# Altium schematic sheet 05_HDMI_to_DP.SchDoc: HDMI to DisplayPort
size A2; Organization: Greenfield Tech Solutions; Address1: Molendreef 33; Address2: Ossendrecht; Address3: 4641CS; Address4: The Netherlands; SheetNumber: 5; SheetTotal: 11
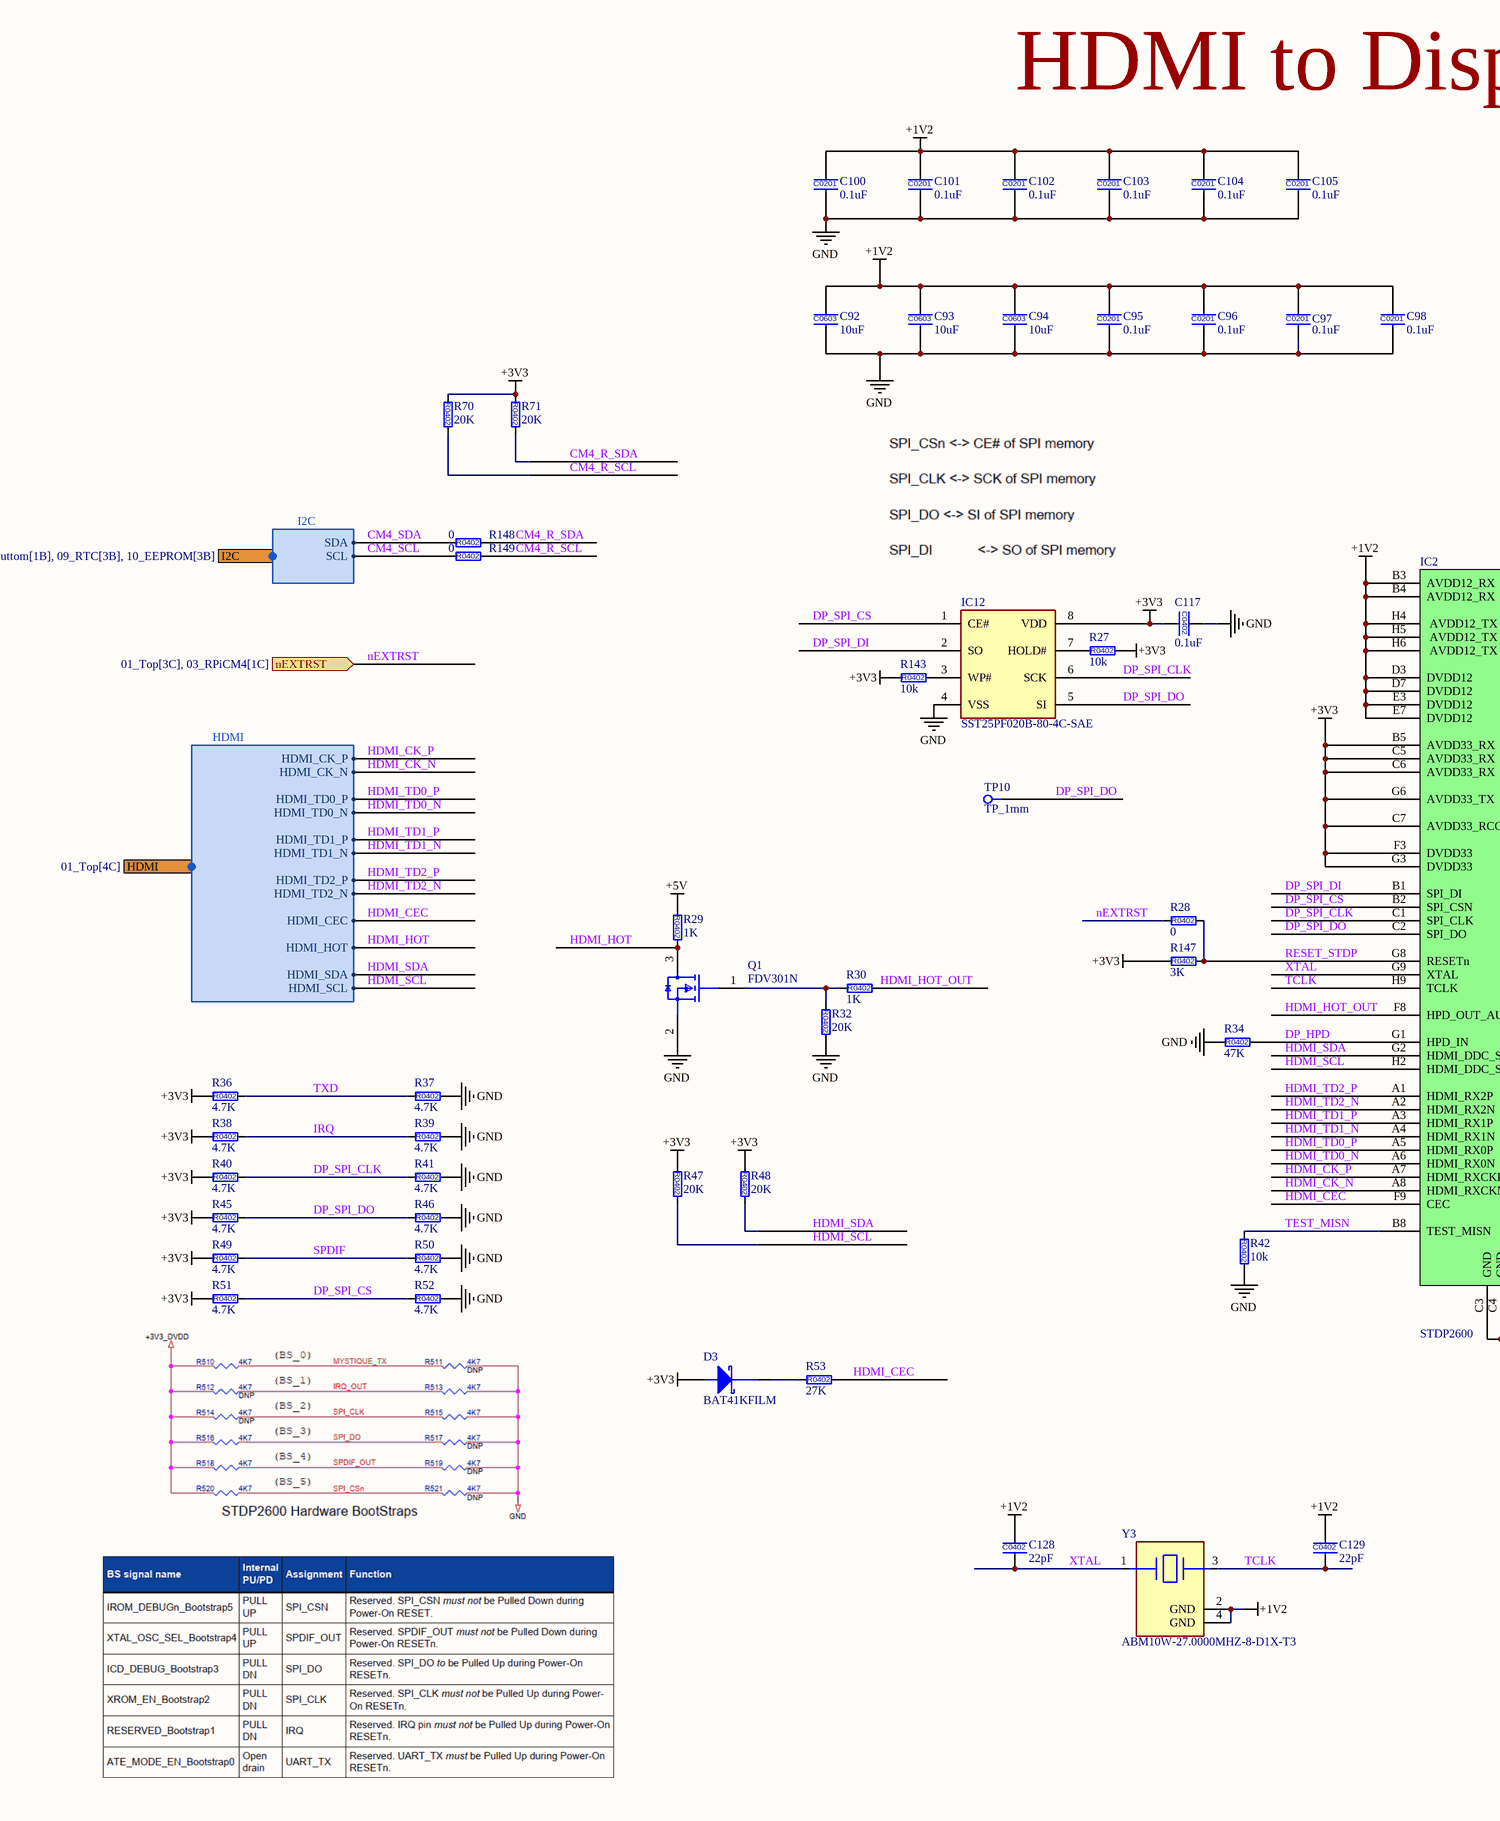
[diagram p0: 05_HDMI_to_DP.SchDoc, left]
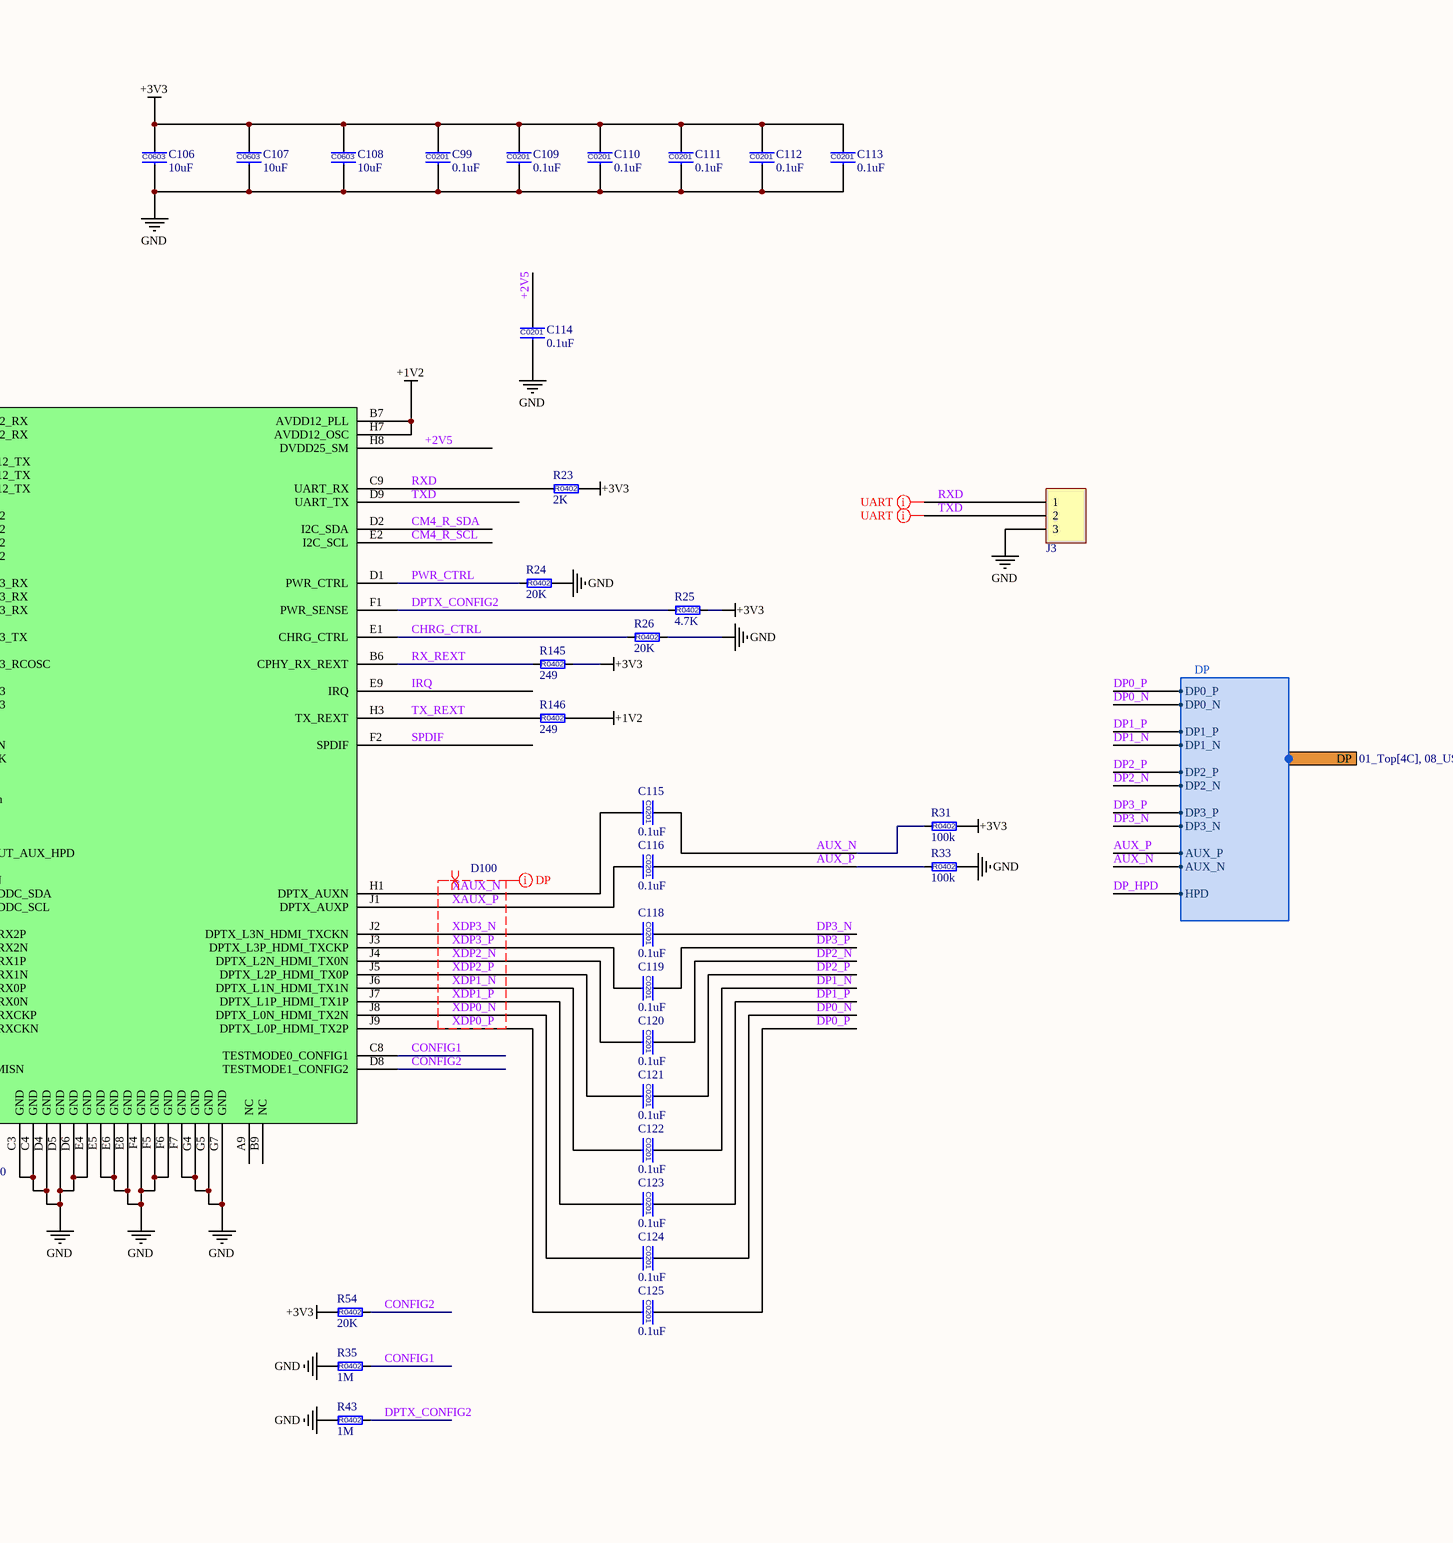
[diagram p1: 05_HDMI_to_DP.SchDoc, right]

## Parts
C92  10uF  [C0603]
C93  10uF  [C0603]
C94  10uF  [C0603]
C95  0.1uF  [C0201]
C96  0.1uF  [C0201]
C97  0.1uF  [C0201]
C98  0.1uF  [C0201]
C99  0.1uF  [C0201]
C100  0.1uF  [C0201]
C101  0.1uF  [C0201]
C102  0.1uF  [C0201]
C103  0.1uF  [C0201]
C104  0.1uF  [C0201]
C105  0.1uF  [C0201]
C106  10uF  [C0603]
C107  10uF  [C0603]
C108  10uF  [C0603]
C109  0.1uF  [C0201]
C110  0.1uF  [C0201]
C111  0.1uF  [C0201]
C112  0.1uF  [C0201]
C113  0.1uF  [C0201]
C114  0.1uF  [C0201]
C115  0.1uF  [C0201]
C116  0.1uF  [C0201]
C117  0.1uF  [C0402]
C118  0.1uF  [C0201]
C119  0.1uF  [C0201]
C120  0.1uF  [C0201]
C121  0.1uF  [C0201]
C122  0.1uF  [C0201]
C123  0.1uF  [C0201]
C124  0.1uF  [C0201]
C125  0.1uF  [C0201]
C128  22pF  [C0402]
C129  22pF  [C0402]
D3  BAT41KFILM  [BAT41KFILM_SOD-523-2]
IC2  STDP2600  [STDP2600_BGA-81]
IC12  SST25PF020B-80-4C-SAE  [SST25PF020B-80-4C-SAE_SOIC_8]
J3  PLS-3  [PLS-3-3D]  (value not drawn)
Q1  FDV301N  [FDV301N_SOT_23]
R23  2K  [R0402]
R24  20K  [R0402]
R25  4.7K  [R0402]
R26  20K  [R0402]
R27  10k  [R0402]
R28  0  [R0402]
R29  1K  [R0402]
R30  1K  [R0402]
R31  100k  [R0402]
R32  20K  [R0402]
R33  100k  [R0402]
R34  47K  [R0402]
R35  1M  [R0402]
R36  4.7K  [R0402]
R37  4.7K  [R0402]
R38  4.7K  [R0402]
R39  4.7K  [R0402]
R40  4.7K  [R0402]
R41  4.7K  [R0402]
R42  10k  [R0402]
R43  1M  [R0402]
R45  4.7K  [R0402]
R46  4.7K  [R0402]
R47  20K  [R0402]
R48  20K  [R0402]
R49  4.7K  [R0402]
R50  4.7K  [R0402]
R51  4.7K  [R0402]
R52  4.7K  [R0402]
R53  27K  [R0402]
R54  20K  [R0402]
R70  20K  [R0402]
R71  20K  [R0402]
R143  10k  [R0402]
R145  249  [R0402]
R146  249  [R0402]
R147  3K  [R0402]
R148  0  [R0402]
R149  0  [R0402]
TP10  TP_1mm  [TP_1MM]  (no BOM)
Y3  ABM10W-27.0000MHZ-8-D1X-T3  [ABM10W]

## Ports
DP (harness DP, see 01_Top[4C], 08_USB_Type-C_DFP_DP_ALT_buttom[1A]), HDMI (harness HDMI, see 01_Top[4C]), I2C (harness I2C, see 01_Top[3C], 03_RPiCM4[1B], 06_USB_Type-C_DFP[1B], 07_USB_Type-C_DFP_DP_ALT[1B], 08_USB_Type-C_DFP_DP_ALT_buttom[1B], 09_RTC[3B], 10_EEPROM[3B]), nEXTRST (in, see 01_Top[3C], 03_RPiCM4[1C])

## Harnesses
DP: DP0_P, DP1_P, DP1_N, DP0_N, DP3_P, DP3_N, DP2_P, DP2_N, AUX_P, AUX_N, HPD
HDMI: HDMI_TD0_P, HDMI_TD1_P, HDMI_TD1_N, HDMI_TD0_N, HDMI_CK_N, HDMI_CK_P, HDMI_TD2_P, HDMI_TD2_N, HDMI_SDA, HDMI_SCL, HDMI_CEC, HDMI_HOT
I2C: SDA, SCL

## Nets
+1V2: C92.1 C93.1 C94.1 C95.1 C96.1 C97.1 C98.1 C100.1 C101.1 C102.1 C103.1 C104.1 C105.1 C128.1 C129.1 IC2.B3(AVDD12_RX) IC2.B4(AVDD12_RX) IC2.B7(AVDD12_PLL) IC2.D3(DVDD12) IC2.D7(DVDD12) IC2.E3(DVDD12) IC2.E7(DVDD12) IC2.H4(AVDD12_TX) IC2.H5(AVDD12_TX) IC2.H6(AVDD12_TX) IC2.H7(AVDD12_OSC) R146.2 Y3.2(GND) Y3.4(GND)
+3V3: C99.1 C106.1 C107.1 C108.1 C109.1 C110.1 C111.1 C112.1 C113.1 C117.2 D3.2(Anode) IC2.B5(AVDD33_RX) IC2.C5(AVDD33_RX) IC2.C6(AVDD33_RX) IC2.C7(AVDD33_RCOSC) IC2.F3(DVDD33) IC2.G3(DVDD33) IC2.G6(AVDD33_TX) IC12.8(VDD) R23.2 R25.2 R27.2 R31.2 R36.1 R38.1 R40.1 R45.1 R47.1 R48.1 R49.1 R51.1 R54.1 R70.1 R71.1 R143.1 R145.2 R147.1
+5V: R29.1
GND: C92.2 C93.2 C94.2 C95.2 C96.2 C97.2 C98.2 C99.2 C100.2 C101.2 C102.2 C103.2 C104.2 C105.2 C106.2 C107.2 C108.2 C109.2 C110.2 C111.2 C112.2 C113.2 C114.2 C117.1 IC2.C3(GND) IC2.C4(GND) IC2.D4(GND) IC2.D5(GND) IC2.D6(GND) IC2.E4(GND) IC2.E5(GND) IC2.E6(GND) IC2.E8(GND) IC2.F4(GND) IC2.F5(GND) IC2.F6(GND) IC2.F7(GND) IC2.G4(GND) IC2.G5(GND) IC2.G7(GND) IC12.4(VSS) J3.3 Q1.2(S) R24.2 R26.2 R32.2 R33.2 R34.1 R35.1 R37.2 R39.2 R41.2 R42.2 R43.1 R46.2 R50.2 R52.2
+2V5: C114.1 IC2.H8(DVDD25_SM)
AUX_N: C115.1 R31.1 ; port DP.AUX_N
AUX_P: C116.1 R33.1 ; port DP.AUX_P
CHRG_CTRL: IC2.E1(CHRG_CTRL) R26.1
CM4_R_SCL: IC2.E2(I2C_SCL) R70.2 R149.2
CM4_R_SDA: IC2.D2(I2C_SDA) R71.2 R148.2
CM4_SCL: R149.1 ; port I2C.SCL
CM4_SDA: R148.1 ; port I2C.SDA
CONFIG1: IC2.C8(TESTMODE0_CONFIG1) R35.2
CONFIG2: IC2.D8(TESTMODE1_CONFIG2) R54.2
DP0_N: C124.1 ; port DP.DP0_N
DP0_P: C125.1 ; port DP.DP0_P
DP1_N: C122.1 ; port DP.DP1_N
DP1_P: C123.1 ; port DP.DP1_P
DP2_N: C120.1 ; port DP.DP2_N
DP2_P: C121.1 ; port DP.DP2_P
DP3_N: C118.1 ; port DP.DP3_N
DP3_P: C119.1 ; port DP.DP3_P
DP_HPD: IC2.G1(HPD_IN) R34.2 ; port DP.HPD
DP_SPI_CLK: IC2.C1(SPI_CLK) IC12.6(SCK) R40.2 R41.1
DP_SPI_CS: IC2.B2(SPI_CSN) IC12.1(CE#) R51.2 R52.1
DP_SPI_DI: IC2.B1(SPI_DI) IC12.2(SO)
DP_SPI_DO: IC2.C2(SPI_DO) IC12.5(SI) R45.2 R46.1 TP10.1
DPTX_CONFIG2: IC2.F1(PWR_SENSE) R25.1 R43.2
HDMI_CEC: IC2.F9(CEC) R53.2 ; port HDMI.HDMI_CEC
HDMI_CK_N: IC2.A8(HDMI_RXCKN) ; port HDMI.HDMI_CK_N
HDMI_CK_P: IC2.A7(HDMI_RXCKP) ; port HDMI.HDMI_CK_P
HDMI_HOT: Q1.3(D) R29.2 ; port HDMI.HDMI_HOT
HDMI_HOT_OUT: IC2.F8(HPD_OUT_AUX_HPD) R30.2
HDMI_SCL: IC2.H2(HDMI_DDC_SCL) R47.2 ; port HDMI.HDMI_SCL
HDMI_SDA: IC2.G2(HDMI_DDC_SDA) R48.2 ; port HDMI.HDMI_SDA
HDMI_TD0_N: IC2.A6(HDMI_RX0N) ; port HDMI.HDMI_TD0_N
HDMI_TD0_P: IC2.A5(HDMI_RX0P) ; port HDMI.HDMI_TD0_P
HDMI_TD1_N: IC2.A4(HDMI_RX1N) ; port HDMI.HDMI_TD1_N
HDMI_TD1_P: IC2.A3(HDMI_RX1P) ; port HDMI.HDMI_TD1_P
HDMI_TD2_N: IC2.A2(HDMI_RX2N) ; port HDMI.HDMI_TD2_N
HDMI_TD2_P: IC2.A1(HDMI_RX2P) ; port HDMI.HDMI_TD2_P
IRQ: IC2.E9(IRQ) R38.2 R39.1
nEXTRST: R28.1 ; port nEXTRST
PWR_CTRL: IC2.D1(PWR_CTRL) R24.1
RESET_STDP: IC2.G8(RESETn) R28.2 R147.2
RX_REXT: IC2.B6(CPHY_RX_REXT) R145.1
RXD: IC2.C9(UART_RX) J3.1 R23.1
SPDIF: IC2.F2(SPDIF) R49.2 R50.1
TCLK: C129.2 IC2.H9(TCLK) Y3.3
TEST_MISN: IC2.B8(TEST_MISN) R42.1
TX_REXT: IC2.H3(TX_REXT) R146.1
TXD: IC2.D9(UART_TX) J3.2 R36.2 R37.1
XAUX_N: C115.2 IC2.H1(DPTX_AUXN)
XAUX_P: C116.2 IC2.J1(DPTX_AUXP)
XDP0_N: C124.2 IC2.J8(DPTX_L0N_HDMI_TX2N)
XDP0_P: C125.2 IC2.J9(DPTX_L0P_HDMI_TX2P)
XDP1_N: C122.2 IC2.J6(DPTX_L1N_HDMI_TX1N)
XDP1_P: C123.2 IC2.J7(DPTX_L1P_HDMI_TX1P)
XDP2_N: C120.2 IC2.J4(DPTX_L2N_HDMI_TX0N)
XDP2_P: C121.2 IC2.J5(DPTX_L2P_HDMI_TX0P)
XDP3_N: C118.2 IC2.J2(DPTX_L3N_HDMI_TXCKN)
XDP3_P: C119.2 IC2.J3(DPTX_L3P_HDMI_TXCKP)
XTAL: C128.2 IC2.G9(XTAL) Y3.1
NetD3_1: D3.1(Cathode) R53.1
NetIC12_3: IC12.3(WP#) R143.2
NetIC12_7: IC12.7(HOLD#) R27.1
NetQ1_1: Q1.1(G) R30.1 R32.1

Not connected (* = marked no-connect by the designer): IC2 A9(NC) B9(NC)

## Layout directives
net class UART_STDP2600: RXD, TXD
net class DP: XAUX_N, XAUX_P, XDP0_N, XDP0_P, XDP1_N, XDP1_P, XDP2_N, XDP2_P, XDP3_N, XDP3_P
differential pair; differential pair class D100: XAUX_N, XAUX_P, XDP0_N, XDP0_P, XDP1_N, XDP1_P, XDP2_N, XDP2_P, XDP3_N, XDP3_P

## Notes on the sheet
- HDMI to Display Port
- Title
- Size:
- Date:
- File:
- A2
- Number:
- Time:
- Revision:
- Sheet
- of
- (in symbol 0603ZD106KAT2A) C0603
- (in symbol 02016D104KAT) C0201
- (in symbol 04023A220KAT2A) C0402
- (in symbol 04023D104KAT2A) C0402
- (in symbol CRCW04021K00FK) R0402
- (in symbol CRCW04021M00FKEDC) R0402
- (in symbol CRCW04022K00FKEE) R0402
- (in symbol CRCW04023K00FKED) R0402
- (in symbol CRCW04024K7FK) R0402
- (in symbol CRCW040210K0FK) R0402
- (in symbol CRCW040220K0FK) R0402
- (in symbol CRCW040227K0FK) R0402
- (in symbol CRCW040247K0FK) R0402
- (in symbol CRCW0402100KFK) R0402
- (in symbol CRCW0402249RFKEDC) R0402
- (in symbol CRCW04020000Z0) R0402

## Library data of the parts
C92-C94 C106-C108 = 0603ZD106KAT2A: CAP CER 10uF 10% 10V X5R 0603; Manufacturer: KYOCERA AVX; Value: 10µF; Manufacturer Part Number: 0603ZD106KAT2A; Tolerance: ±10%; Voltage - Rated: 10V; Temperature Coefficient: X5R
C95-C105 C109-C116 C118-C125 = 02016D104KAT: CAP CER  0.1uF 10% 6.3V X5R 0201; Manufacturer: AVX Corporation; Capacitance: 100nF; Category: Capacitors; Manufacturer Part Number: 02016D104KAT; Operating Temperature: -55°C ~ 85°C; Package / Case: 0201; Value: 0.1uF; Voltage - Rated: 6.3V; Supplier: Digi-Key; Tolerance: ±10%; Temperature Coefficient: X5R; Mounting Type: Surface Mount, MLCC
C117 = 04023D104KAT2A: CAP CER  0.1uF 10% 25V X5R 0402; Manufacturer: AVX Corporation; Manufacturer Part Number: 04023D104KAT2A; Value: 0.1uF; Voltage - Rated: 25V; Tolerance: ±10%; Temperature Coefficient: X5R
C128 C129 = 04023A220KAT2A: CAP CER 22pF 10% 25V NP0 0402; Manufacturer: KYOCERA AVX; Manufacturer Part Number: 04023A220KAT2A; Operating Temperature: -55°C ~ 125°C; Package / Case: 0402 (1005 Metric); Value: 22pF; Voltage - Rated: 25V; Tolerance: ±10%; Temperature Coefficient: NP0
D3 = BAT41KFILM: DIODE SCHOTTKY 100V 200MA SOD523; Manufacturer: STMicroelectronics; Max Junction Temp: +150°C; Max Surge Forward Current: 1A; Capacitance: 3pF; Peak Reverse Current: 0.1uA; Value: 3pF; Automotive: No; Max Repetitive Reverse Voltage: 100V; Octopart: https://octopart.com/bat41kfilm-stmicroelectronics-658186; Temperature Range High: +150°C; Digikey Description: DIODE SCHOTTKY 100V 200MA SOD523; Device Class L2: Diodes; Forward Current: 200mA; Device Class L1: Discrete Semiconductors; Lead Free: Yes; Temperature: to +150°C; Manufacturer Part Number: BAT41KFILM; Mouser Description: Schottky Diodes & Rectifiers schottky diode; Height: 0.7mm; RoHS: TRUE; ComponentLink2Description: Datasheet; Device Class L3: Schottky Diodes; Category: Diode; Package: SOD-523; ComponentLink2URL: https://www.st.com/resource/en/datasheet/bat41.pdf
IC2 = STDP2600: Advanced HDMI to DisplayPort converter; Part Number: IC0077; Manufacturer: Kinetic Technologies; Manufacturer Part Number: STDP2600ADT; ID: 77; ManfactPart: STDP2600; Supplier 1: Digi-Key; RoHS: No; Category: Interface ICs; Stock 1: 8132; Pricing 1: 1=8.94000, 10=8.04900, 25=7.58240, 50=7.38820, 100=7.19370, 250=6.41604, 500=6.02718, 1000=5.32724 (USD); Supplier Part Number 1: 1654-STDP2600ADTCT-ND; RefVal: STDP2600
IC12 = SST25PF020B-80-4C-SAE: 150 mils SOIC 2.3-3.6V 2 Mbit SPI Flash 8 SOIC 3.90mm(.150in) TUBE RoHS Compliant: Yes; Manufacturer_Name: Microchip; Address Bus Width: 1b; Interface: SPI,Serial; Min Supply Voltage: 2.3V; Max Supply Voltage: 3.6V; Nominal Supply Current: 30mA; Density: 2Mb; Access Time: 12ns; Memory Type: NOR,Non-Volatile,FLASH; Frequency: 80MHz; Max Supply Current: 15mA; Data Bus Width: 8b; Datasheet Link: https://componentsearchengine.com/Datasheets/3/SST25PF020B-80-4C-SAE.pdf; Height: 1.75mm; Manufacturer_Part_Number: SST25PF020B-80-4C-SAE; Mouser Part Number: 579-020B-80-4C-SAE; Mouser Price/Stock: https://www.mouser.com/Search/Refine.aspx?Keyword=579-020B-80-4C-SAE; Arrow Part Number: SST25PF020B-80-4C-SAE; Arrow Price/Stock: https://www.arrow.com/en/products/sst25pf020b-80-4c-sae/microchip-technology?region=europe; Supplier 1: Digi-Key; Manufacturer: Microchip; Manufacturer Part Number: SST25PF020B-80-4C-SAE; RoHS: Yes; Category: Flash; Stock 1: 289; Pricing 1: 1=1.03000, 25=0.97520, 100=0.94340 (USD); Mount: Surface Mount; Case/Package: SOIC; Number of Pins: 8; Weight: 0.019048oz; Min Operating Temperature: 0°C; Max Operating Temperature: 70°C; Packaging: Rail/Tube; Package Quantity: 100; Memory Size: 2Mb; Max Frequency: 80MHz; Series: SST25; Access Time-Max: 12ns; Supply Current: 30mA; Programming Voltage: 3.6V; Length: 5mm; Width: 4mm; Radiation Hardening: No; RoHS Compliant: Yes; Reach SVHC Compliant: Yes; ComponentLink1URL: https://datasheet.ciiva.com/30477/0900766b8127faed-30477881.pdf?src-supplier=RSComponents; ComponentLink1Description: https://datasheet.ciiva.com/30477/0900766b8127faed-30477881.pdf?src-supplier=RSComponents; ComponentLink2URL: https://datasheet.ciiva.com/26296/sst25pf020b-eng-tds-26296972.pdf?src-supplier=Distrelec; ComponentLink2Description: https://datasheet.ciiva.com/26296/sst25pf020b-eng-tds-26296972.pdf?src-supplier=Distrelec; ComponentLink3URL: https://datasheet.ciiva.com/30020/25135a-30020558.pdf?src-supplier=Avnet; ComponentLink3Description: https://datasheet.ciiva.com/30020/25135a-30020558.pdf?src-supplier=Avnet; ComponentLink4URL: https://datasheet.ciiva.com/15048/20005135b-15048474.pdf?src-supplier=Digi-Key; ComponentLink4Description: https://datasheet.ciiva.com/15048/20005135b-15048474.pdf?src-supplier=Digi-Key; Supplier Part Number 1: SST25PF020B-80-4C-SAE-ND
J3 = PLS-3: Board to Board Connector Straight Header Single Row 3 Position 2.54mm Pitch Through Hole Bag; Manufacturer: Amphenol; Manufacturer Part Number: G800W305018EU; Supplier 1: Mouser; RoHS: Yes; Category: Connectors; Stock 1: 26660; Pricing 1: 1=0.10000, 10=0.04200, 50=0.04200, 100=0.04000, 1000=0.03500, 10000=0.03000 (USD); Supplier Part Number 1: 523-G800W305018EU
Q1 = FDV301N: MOSFET N-CH 25V 220MA SOT-23; Manufacturer: ON Semiconductor; Turn Off Delay Time: 3.5ns; Typ Forward Diode Voltage: 0.8V; Max Junction Temp: +150°C; Threshold Vgs Max: 1.06V; Threshold Vgs Min: 0.7V; Standoff Height: 0.01mm; Max Forward Diode Voltage: 1.2V; Number Of Channels: 1; Rthja Max: 357°C/W; Drain To Source Resistance: 3.1Ω; Input Capacitace At Vds: 9.5pF @ 10V; Gate Charge At Vgs: 0.49nC @ 4.5V; Transconductance: 0.2S; Turn On Delay Time: 3.2ns; Depletion Mode: False; Power Dissipation: 0.35W; Continuous Drain Current: 0.22A; Gate To Source Voltage: 8V; RoHS: TRUE; Lead Free: Yes; Temperature Range High: +150°C; Automotive: No; Height: 1.11mm; Category: Trans; Mouser Description: MOSFET N-Ch Digital; Drain To Source Voltage: 25V; Temperature: -55°C to +150°C; Ipc Land Pattern Name: SOT95P240X100-3; Device Class L1: Discrete Semiconductors; Octopart: https://octopart.com/fdv301n-on+semiconductor-84326713; Footprint Url: https://www.onsemi.com/pub/Collateral/318-08.PDF; Digikey Description: MOSFET N-CH 25V 220MA SOT-23; Drain To Source Breakdown Voltage: 25V; Temperature Range Low: -55°C; Number Of N Channels: 1; Device Class L3: MOSFETs; Package: 318-08; ComponentLink2URL: https://www.onsemi.com/pub/Collateral/FDV301N-D.PDF; Manufacturer Part Number: FDV301N; Device Class L2: Transistors; ComponentLink2Description: Datasheet
R23 = CRCW04022K00FKEE: RES SMD 2K ohm 1% 1/16W R0402; Manufacturer: Vishay; check: ok; Manufacturer Part Number: CRCW04022K00FKEE; Value: 2K; Power (Watts): 1/16W; Package / Case: 0805 (2012 Metric); Tolerance: ±1%
R24 R26 R32 R47 R48 R54 R70 R71 = CRCW040220K0FK: RES SMD 20K ohm 1% 1/16W R0402; Manufacturer: Vishay Dale; Manufacturer Part Number: CRCW040220K0FK; Value: 20K; Power (Watts): 1/16W; Package / Case: 0402; Tolerance: ±1%
R25 R36-R41 R45 R46 R49-R52 = CRCW04024K7FK: RES SMD 4.7K ohm 1% 1/16W R0402; Manufacturer: Vishay Dale; Manufacturer Part Number: CRCW04024K7FK; Value: 4.7K; Power (Watts): 1/16W; Package / Case: 0402; Tolerance: ±1%
R27 R42 R143 = CRCW040210K0FK: RES SMD 10K ohm 1% 1/16W R0402; Manufacturer: Vishay Dale; Manufacturer Part Number: CRCW040210K0FK; Value: 10K; Power (Watts): 1/16W; Package / Case: 0402; Tolerance: ±1%
R28 R148 R149 = CRCW04020000Z0: RES SMD 0 ohm 1/16W R0402; Manufacturer: Vishay Dale; Manufacturer Part Number: CRCW04020000Z0; Value: 0; Power (Watts): 1/16W; Package / Case: 0402
R29 R30 = CRCW04021K00FK: RES SMD 1K ohm 1% 1/16W R0402; Manufacturer: Vishay Dale; Manufacturer Part Number: CRCW04021K00FK; Value: 1K; Power (Watts): 1/16W; Package / Case: 0402; Tolerance: ±1%
R31 R33 = CRCW0402100KFK: RES SMD 100K ohm 1% 1/16W R0402; Manufacturer: Vishay Dale; Manufacturer Part Number: CRCW0402100KFK; Value: 100K; Power (Watts): 1/16W; Package / Case: 0402; Tolerance: ±1%
R34 = CRCW040247K0FK: RES SMD 47K ohm 1% 1/16W R0402; Manufacturer: Vishay Dale; Manufacturer Part Number: CRCW040247K0FK; Value: 47K; Power (Watts): 1/16W; Package / Case: 0402; Tolerance: ±1%
R35 R43 = CRCW04021M00FKEDC: RES SMD 1M ohm 1% 1/16W R0402; Manufacturer: Vishay; check: ok; Manufacturer Part Number: CRCW04021M00FKEDC; Value: 1M; Power (Watts): 1/16W; Package / Case: 0402; Tolerance: ±1%
R53 = CRCW040227K0FK: RES SMD 27K ohm 1% 1/16W R0402; Manufacturer: Vishay Dale; Manufacturer Part Number: CRCW040227K0FK; Value: 27K; Power (Watts): 1/16W; Package / Case: 0402; Tolerance: ±1%
R145 R146 = CRCW0402249RFKEDC: RES SMD 249 ohm 1% 1/16W R0402; Manufacturer: Vishay; check: ok; Manufacturer Part Number: CRCW0402249RFKEDC; Value: 249; Power (Watts): 1/16W; Package / Case: 0402; Tolerance: ±1%
R147 = CRCW04023K00FKED: RES SMD 3K ohm 1% 1/16W R0402; Manufacturer: Vishay; check: ok; Manufacturer Part Number: CRCW04023K00FKED; Value: 3K; Power (Watts): 1/16W; Package / Case: 0402; Tolerance: ±1%
TP10 = TP_1mm: Testpoint 1mm; Manufacturer Part Number: General Test Point
Y3 = ABM10W-27.0000MHZ-8-D1X-T3: CRYSTAL 27.0000MHZ 8PF SMD, 2.5x2mm, RoHS; Manufacturer: Abracon; Supplier 1: Digi-Key; Manufacturer Part Number: ABM10W-27.0000MHZ-8-D1X-T3; RoHS: Yes; Category: Crystals; Stock 1: 1759; Pricing 1: 1=0.73000, 10=0.60600, 50=0.54540, 100=0.48480, 500=0.46056, 1000=0.38784 (USD); Supplier Part Number 1: 535-ABM10W-27.0000MHZ-8-D1X-T3CT-ND; Supplier 2: Digi-Key; Stock 2: 1759; Pricing 2: 1=0.73000, 10=0.60600, 50=0.54540, 100=0.48480, 500=0.46056, 1000=0.38784 (USD); Supplier Part Number 2: 535-ABM10W-27.0000MHZ-8-D1X-T3DKR-ND